# Altium schematic sheet 06_Ethernet_Interface.SchDoc: Mainboard Ethernet
size A3; SheetNumber: 10; SheetTotal: 13
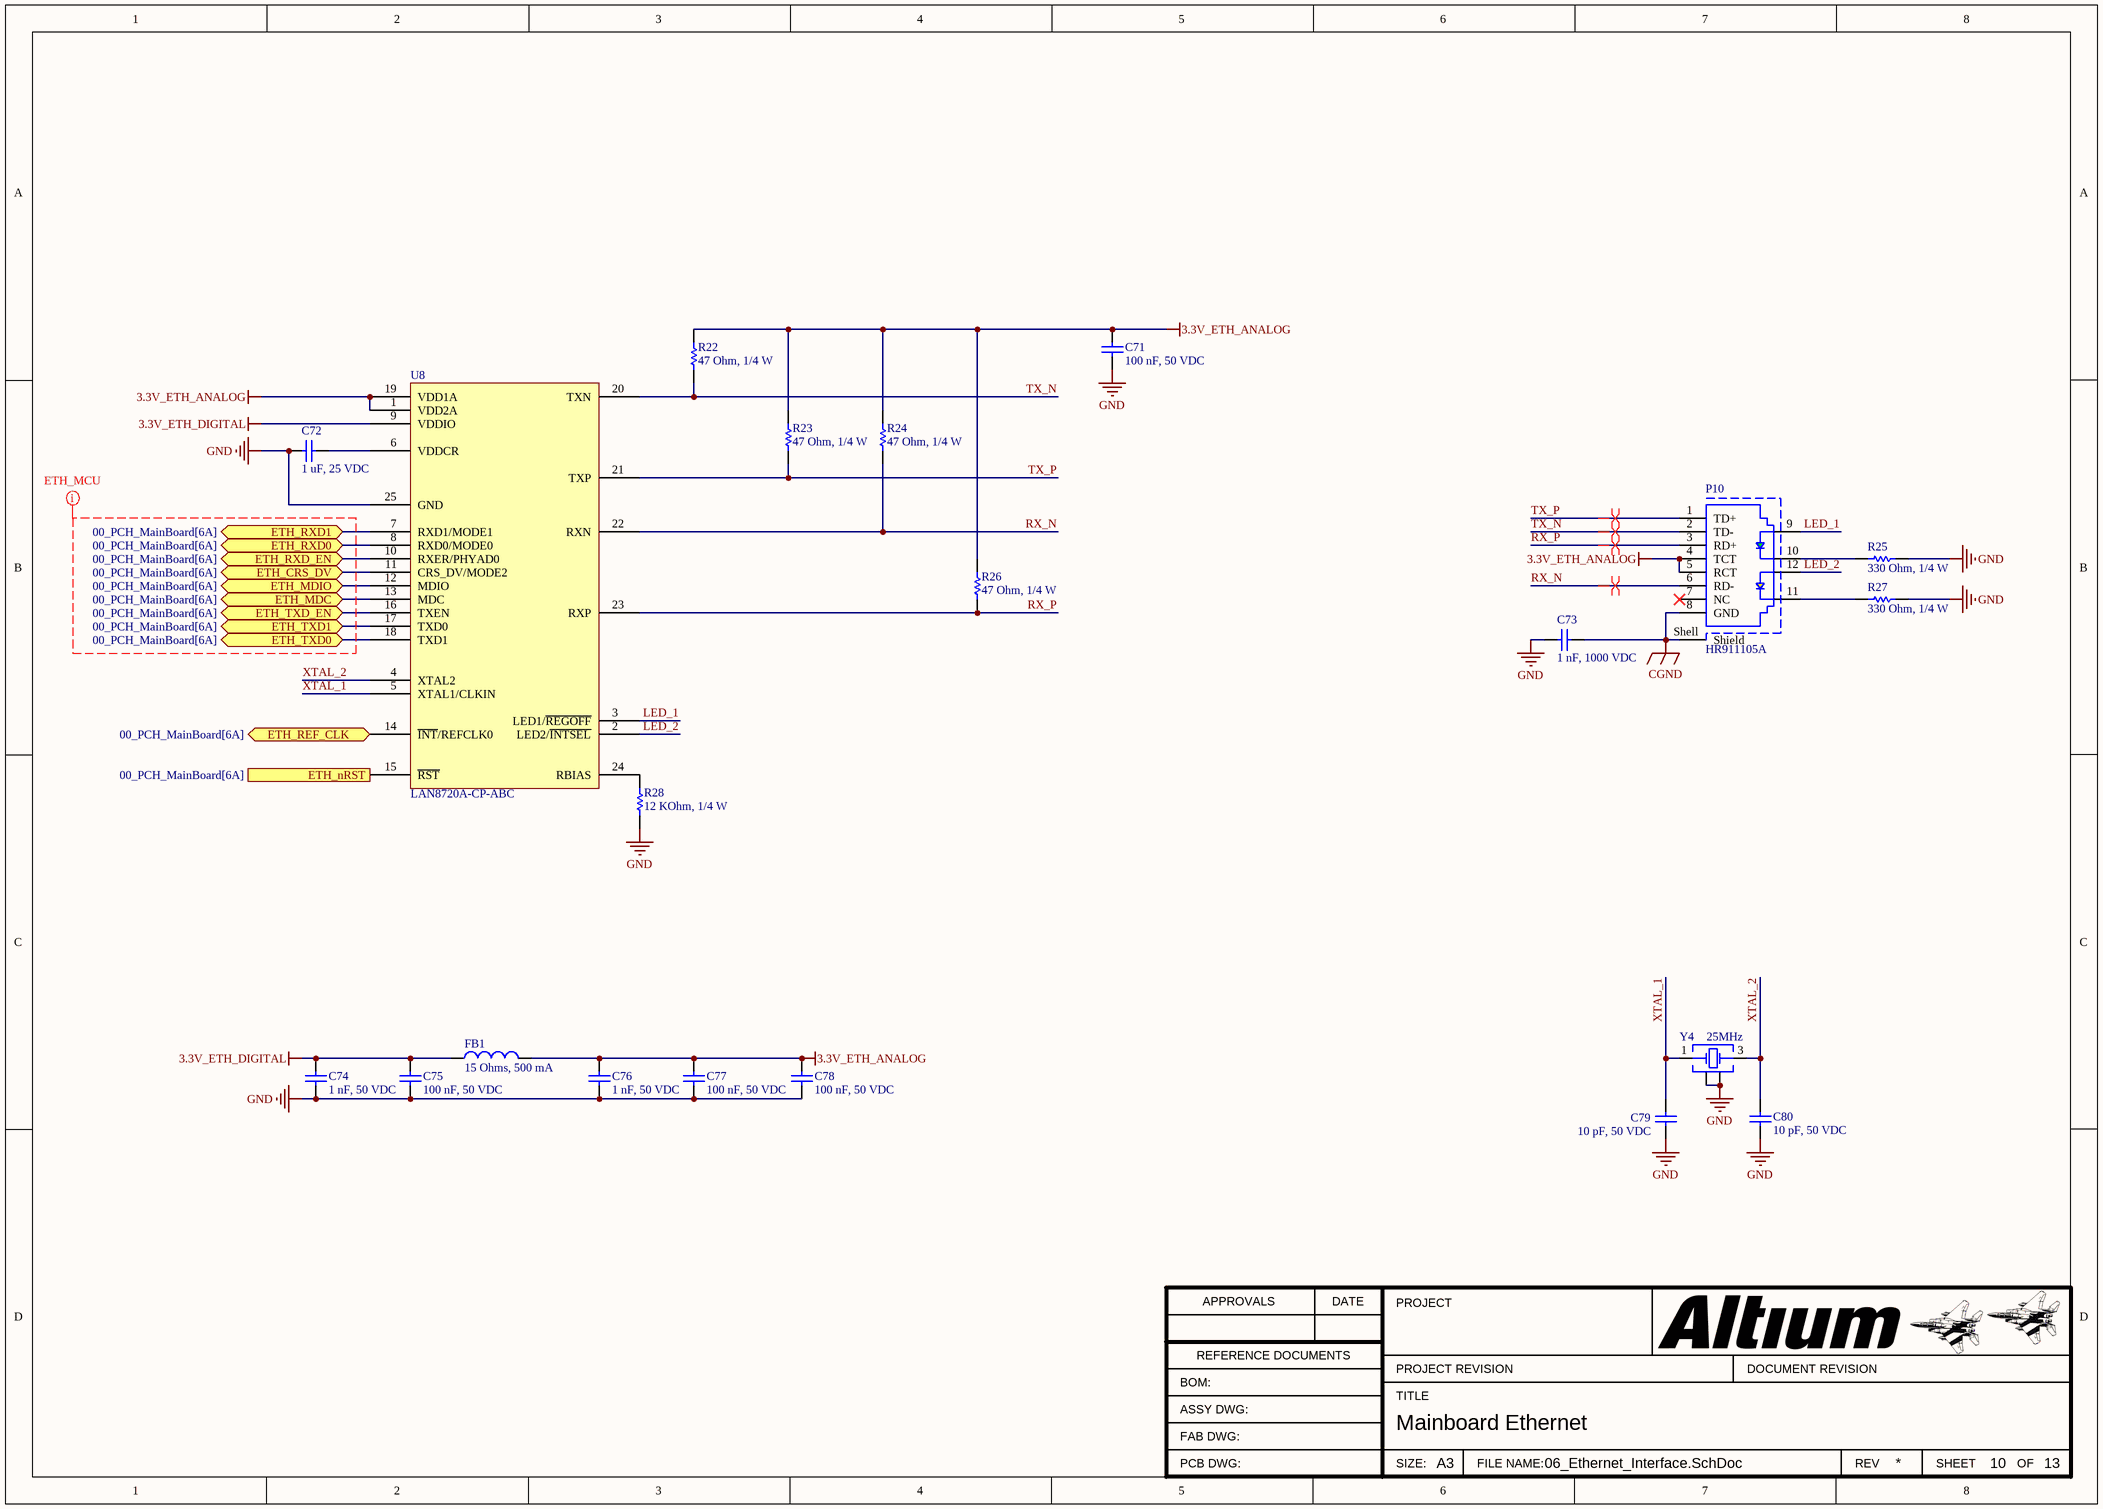
[diagram p0: 06_Ethernet_Interface.SchDoc]

## Parts
C71  100 nF, 50 VDC  [CAP_0603]
C72  1 uF, 25 VDC  [CAP_0603]
C73  1 nF, 1000 VDC  [CAP1210]
C74  1 nF, 50 VDC  [CAP_0603]
C75  100 nF, 50 VDC  [CAP_0603]
C76  1 nF, 50 VDC  [CAP_0603]
C77  100 nF, 50 VDC  [CAP_0603]
C78  100 nF, 50 VDC  [CAP_0603]
C79  10 pF, 50 VDC  [CAP_0603]
C80  10 pF, 50 VDC  [CAP_0603]
FB1  15 Ohms, 500 mA  [FER_0603]
P10  HR911105A  [HANRUN_HR911105A]
R22  47 Ohm, 1/4 W  [resistor_0603]
R23  47 Ohm, 1/4 W  [resistor_0603]
R24  47 Ohm, 1/4 W  [resistor_0603]
R25  330 Ohm, 1/4 W  [resistor_0603]
R26  47 Ohm, 1/4 W  [resistor_0603]
R27  330 Ohm, 1/4 W  [resistor_0603]
R28  12 KOhm, 1/4 W  [resistor_0603]
U8  LAN8720A-CP-ABC  [LAN8720A-CP-ABC]
Y4  25MHz  [WE-XTAL_CFPX-180]

## Ports
ETH_CRS_DV (bidir, see 00_PCH_MainBoard[6A]), ETH_MDC (bidir, see 00_PCH_MainBoard[6A]), ETH_MDIO (bidir, see 00_PCH_MainBoard[6A]), ETH_nRST (in, see 00_PCH_MainBoard[6A]), ETH_REF_CLK (bidir, see 00_PCH_MainBoard[6A]), ETH_RXD0 (bidir, see 00_PCH_MainBoard[6A]), ETH_RXD1 (bidir, see 00_PCH_MainBoard[6A]), ETH_RXD_EN (bidir, see 00_PCH_MainBoard[6A]), ETH_TXD0 (bidir, see 00_PCH_MainBoard[6A]), ETH_TXD1 (bidir, see 00_PCH_MainBoard[6A]), ETH_TXD_EN (bidir, see 00_PCH_MainBoard[6A])

## Nets
3.3V_ETH_ANALOG: C71.2 C76.2 C77.2 C78.2 FB1.2 P10.4(TCT) P10.5(RCT) R22.2 R23.2 R24.2 R26.2 U8.1(VDD2A) U8.19(VDD1A)
3.3V_ETH_DIGITAL: C74.2 C75.2 FB1.1 U8.9(VDDIO)
CGND: C73.2 P10.8(GND) P10.Shell(Shield)
GND: C71.1 C72.1 C73.1 C74.1 C75.1 C76.1 C77.1 C78.1 C79.1 C80.1 R25.2 R27.2 R28.1 U8.25(GND) Y4.2(GND) Y4.4(GND)
ETH_CRS_DV: U8.11(CRS_DV/MODE2) ; port ETH_CRS_DV
ETH_MDC: U8.13(MDC) ; port ETH_MDC
ETH_MDIO: U8.12(MDIO) ; port ETH_MDIO
ETH_nRST: U8.15(~{RST}) ; port ETH_nRST
ETH_REF_CLK: U8.14(~{INT}/REFCLK0) ; port ETH_REF_CLK
ETH_RXD0: U8.8(RXD0/MODE0) ; port ETH_RXD0
ETH_RXD1: U8.7(RXD1/MODE1) ; port ETH_RXD1
ETH_RXD_EN: U8.10(RXER/PHYAD0) ; port ETH_RXD_EN
ETH_TXD0: U8.18(TXD1) ; port ETH_TXD0
ETH_TXD1: U8.17(TXD0) ; port ETH_TXD1
ETH_TXD_EN: U8.16(TXEN) ; port ETH_TXD_EN
LED_1: P10.9 U8.3(LED1/~{REGOFF})
LED_2: P10.12 U8.2(LED2/~{INTSEL})
RX_N: P10.6(RD-) R24.1 U8.22(RXN)
RX_P: P10.3(RD+) R26.1 U8.23(RXP)
TX_N: P10.2(TD-) R22.1 U8.20(TXN)
TX_P: P10.1(TD+) R23.1 U8.21(TXP)
XTAL_1: C79.2 U8.5(XTAL1/CLKIN) Y4.1(Crystal)
XTAL_2: C80.2 U8.4(XTAL2) Y4.3(Crystal)
NetC72_2: C72.2 U8.6(VDDCR)
NetP10_10: P10.10 R25.1
NetP10_11: P10.11 R27.1
NetR28_2: R28.2 U8.24(RBIAS)

Not connected (* = marked no-connect by the designer): P10 7(NC)*

## Layout directives
net class ETH_MCU: (no net found under the mark)
differential pair; differential pair class ETH_TX; net class ETH: TX_N, TX_P
differential pair; differential pair class ETH_RX; net class ETH: RX_N, RX_P

## Notes on the sheet
- APPROVALS
- DATE
- PROJECT
- BOM:
- REFERENCE DOCUMENTS
- TITLE
- PROJECT REVISION
- DOCUMENT REVISION
- ASSY DWG:
- FAB DWG:
- PCB DWG:
- SIZE:
- A3
- FILE NAME:
- REV
- SHEET
- OF

## Library data of the parts
C71 C75 C77 C78 = 0106031041050: CAP, size 0603, 100 nF, 50 VDC; Manufacture Name: TDK; Manufacture SN: CGA3E3X8R1H104K080AE; Capacitance: 100 nF; Tolerance: +/-10%; Voltage Rating DC: 50 VDC; ComponentLink2Description: Datasheet; ComponentLink2URL: https://product.tdk.com/system/files/dam/doc/product/capacitor/ceramic/mlcc/catalog/mlcc_automotive_soft_en.pdf?ref_disty=mouser; Operating Temperature: -55 to +125degC; Packaging: Tape and Reel; Mounting Technology: SMT; Size: 0603; Supplier 1 Name: Mouser; Supplier 1 SN: 810-CGA3E3X8R1H104KA; Supplier 1 URL: https://www.mouser.com/ProductDetail/TDK/CGA3E3X8R1H104K080AE?qs=nQSIdc08i%252Bd8g3IRRgU2bw%3D%3D&utm_source=mouser-refine-download&utm_medium=file&utm_campaign=CGA3E3X8R1H104K080AE&utm_content=TDK; Supplier 2 Name: Digi-Key; Supplier 2 SN: 445-173697-2-ND; Supplier 2 URL: https://www.digikey.com/en/products/detail/tdk-corporation/cga3e3x8r1h104k080ae/5809262; Supplier 3 Name: thegioiic; Supplier 3 SN: N/A; Supplier 3 URL: N/A; Value: 100 nF, 50 VDC
C72 = 0106031051025: CAP, size 0603, 1 uF, 25 VDC; Manufacture Name: Samsung Electro-Mechanics; Manufacture SN: CL10A105KA8NNNC; Capacitance: 1 uF; Tolerance: +/-10%; Voltage Rating DC: 25 VDC; ComponentLink2Description: Datasheet; ComponentLink2URL: https://www.mouser.vn/datasheet/2/585/MLCC-1837944.pdf; Operating Temperature: -55 to +125degC; Packaging: Tape and Reel; Mounting Technology: SMT; Size: 0603; Supplier 1 Name: Mouser; Supplier 1 SN: 187-CL10A105KA8NNNC; Supplier 1 URL: https://www.mouser.vn/ProductDetail/Samsung-Electro-Mechanics/CL10A105KA8NNNC?qs=hqM3L16%252BxldY%252BnK4KzDJVg%3D%3D&utm_source=mouser-refine-download&utm_medium=file&utm_campaign=CL10A105KA8NNNC&utm_content=Samsung-Electro-Mechanics; Supplier 2 Name: Digi-Key; Supplier 2 SN: 1276-1102-2-ND; Supplier 2 URL: https://www.digikey.com/en/products/detail/samsung-electro-mechanics/cl10a105ka8nnnc/3886760; Supplier 3 Name: thegioiic; Supplier 3 SN: N/A; Supplier 3 URL: N/A; Value: 1 uF, 25 VDC
C73 = 011210102101000: CAP, size 1210, 1nF, 1000 VDC; Manufacture Name: TDK; Manufacture SN: C3225C0G3A102J200AE; Tolerance: +/-10%; Capacitance: 1 nF; ComponentLink2Description: Supplier 1 URL; ComponentLink2URL: N/A; Mounting Technology: SMT; Operating Temperature: -55 to +125degC; Packaging: Tape and Reel; Size: 0805; Supplier 1 Name: Mouser; Supplier 1 SN: N/A; Supplier 1 URL: N/A; Supplier 2 Name: Digi-Key; Supplier 2 SN: N/A; Supplier 2 URL: N/A; Supplier 3 Name: thegioiic; Supplier 3 SN: OEM; Supplier 3 URL: https://www.thegioiic.com/tu-gom-1210-1nf-1kv; Value: 1 nF, 1000 VDC; Voltage Rating DC: 1000 VDC; ComponentLink1Description: Datasheet link; ComponentLink1URL: https://product.tdk.com/system/files/dam/doc/product/capacitor/ceramic/mlcc/catalog/mlcc_commercial_soft_en.pdf?ref_disty=mouser; ComponentLink3Description: Supplier 2 URL; ComponentLink3URL: N/A; ComponentLink4Description: Supplier 3 URL; ComponentLink4URL: https://www.thegioiic.com/tu-gom-1210-1nf-1kv
C74 C76 = 0106031051050: CAP, size 0603, 1 nF, 50 VDC; Manufacture Name: TDK; Manufacture SN: CGA3E3X5R1H105K080AB; Capacitance: 1 nF; Tolerance: +/-10%; Voltage Rating DC: 50 VDC; ComponentLink2Description: Datasheet; ComponentLink2URL: https://product.tdk.com/system/files/dam/doc/product/capacitor/ceramic/mlcc/catalog/mlcc_automotive_general_en.pdf?ref_disty=mouser; Operating Temperature: -55 to +125degC; Packaging: Tape and Reel; Mounting Technology: SMT; Size: 0603; Supplier 1 Name: Mouser; Supplier 1 SN: 810-CGA3E3X5R1H105K; Supplier 1 URL: https://www.mouser.com/ProductDetail/TDK/CGA3E3X5R1H105K080AB?qs=NRhsANhppD%2F2%2FwbVN4GABg%3D%3D&utm_source=mouser-refine-download&utm_medium=file&utm_campaign=CGA3E3X5R1H105K080AB&utm_content=TDK; Supplier 2 Name: Digi-Key; Supplier 2 SN: 445-7878-2-ND; Supplier 2 URL: https://www.digikey.com/en/products/detail/tdk-corporation/cga3e3x5r1h105k080ab/2781304; Supplier 3 Name: thegioiic; Supplier 3 SN: N/A; Supplier 3 URL: N/A; Value: 1 nF, 50 VDC
C79 C80 = 0106031000550: CAP, size 0603, 10 pF, 50 VDC; Manufacture Name: TDK; Manufacture SN: CGA3E2NP01H100D080AA; Capacitance: 10 pF; Tolerance: +/-5%; Voltage Rating DC: 50 VDC; ComponentLink2Description: Datasheet; ComponentLink2URL: https://product.tdk.com/system/files/dam/doc/product/capacitor/ceramic/mlcc/catalog/mlcc_automotive_hightemp_en.pdf?ref_disty=mouser; Operating Temperature: -55 to +125degC; Packaging: Tape and Reel; Mounting Technology: SMT; Size: 0603; Supplier 1 Name: Mouser; Supplier 1 SN: 810-CGA3E2NP01H100DA; Supplier 1 URL: https://www.mouser.com/ProductDetail/TDK/CGA3E2NP01H100D080AA?qs=xLDY6iXSiQYSDBjUp7bVxg%3D%3D&utm_source=mouser-refine-download&utm_medium=file&utm_campaign=CGA3E2NP01H100D080AA&utm_content=TDK; Supplier 2 Name: Digi-Key; Supplier 2 SN: 445-12387-2-ND; Supplier 2 URL: https://www.digikey.com/en/products/detail/tdk-corporation/cga3e2np01h100d080aa/3949623; Supplier 3 Name: thegioiic; Supplier 3 SN: N/A; Supplier 3 URL: N/A; Value: 10 pF, 50 VDC
FB1 = 03060315050125: Ferrite, 0603, 15 Ohms, 500 mA; Manufacture Name: Wurth Elektronik; Manufacture SN: 74279268; Tolerance: +/-25%; Impedance: 15 Ohms; Maximum DC Current: 500 mA; Maximum DC Resistance: 100 mOhms; Test Frequency: 100 MHz; ComponentLink2Description: Datasheet; ComponentLink2URL: https://www.we-online.com/catalog/datasheet/74279268.pdf; Mounting Technology: SMT; Operating Temperature: -55 to +125degC; Packaging: Tape and Reel; Size: 0603; Supplier 1 SN: 710-74279268; Supplier 1 URL: https://www.mouser.com/ProductDetail/Wurth-Elektronik/74279268?qs=sGAEpiMZZMt1hubY80%2Fs8M60rIzA20dg6AqiZmQw0jA%3D&utm_source=mouser-refine-download&utm_medium=file&utm_campaign=74279268&utm_content=Wurth-Elektronik; Supplier 2 SN: N/A; Supplier 2 URL: N/A; Supplier 3 SN: N/A; Supplier 3 URL: N/A; Supplier 1 Name: Mouser; Supplier 2 Name: Digi-Key; Supplier 3 Name: thegioiic; Value: 15 Ohms, 500 mA
P10 = HANRUN_HR911105A: Single Port RJ45 Connector with Integrated Magnetics and LED; ComponentLink2Description: Supplier 1 URL; ComponentLink2URL: N/A; Manufacture Name: N/A; Manufacture SN: N/A; Mounting Technology: THT; Operating Temperature: -55 to +125degC; Packaging: N/A; Supplier 1 Name: Mouser; Supplier 1 SN: N/A; Supplier 1 URL: N/A; Supplier 2 Name: Digi-Key; Supplier 2 SN: N/A; Supplier 2 URL: N/A; Supplier 3 Name: thegioiic; Supplier 3 SN: HR911105A; Supplier 3 URL: https://www.thegioiic.com/hr911105a-cong-rj45-cai-co-led-hanrun; Value: HR911105A; ComponentLink1Description: Datasheet link; ComponentLink1URL: https://tme.vn/upload/pdf/HR911105A.pdf; ComponentLink3Description: Supplier 2 URL; ComponentLink3URL: N/A; ComponentLink4Description: Supplier 3 URL; ComponentLink4URL: https://www.thegioiic.com/hr911105a-cong-rj45-cai-co-led-hanrun
R22-R24 R26 = 0006034701: RES, size 0603, 47 Ohm, 1/4 W; Manufacture  Name: OEM; Rated Power: 1/4 W; Resistance: 47 Ohm; Resistance Tolerance: +/-1%; Size: 0603; Mounting Technology: SMT; Supplier 1 Name: Mouser; Supplier 1 SN: 667-ERJ-UP3F47R0V; Supplier 1 URL: https://www.mouser.vn/ProductDetail/Panasonic/ERJ-UP3F47R0V?qs=GedFDFLaBXE9d1Rnv%2Fokmg%3D%3D; Supplier 2 Name: Digi-Key; Supplier 2 SN: 10-ERJ-UP3F47R0VTR-ND - Tape & Reel (TR); Supplier 3 Name: thegioiic; Supplier 3 SN: N/A; Supplier 3 URL: N/A; Manufacture  SN: OEM; Value: 47 Ohm, 1/4 W; ComponentLink1Description: Datasheet link; ComponentLink1URL: https://www.mouser.vn/datasheet/2/315/Panasonic_Resistors_Thick_Film_Anti_Sulf_Anti_Surg-1825099.pdf; ComponentLink2Description: Supplier 1 URL; ComponentLink2URL: N/A; ComponentLink3Description: Supplier 2 URL; ComponentLink3URL: https://www.digikey.com/en/products/detail/panasonic-electronic-components/ERJ-UP3F47R0V/12092512?s=N4IgTCBcDaIGxwOwFoCiAlAUsgqgBQGYAxAFkXQAYA1EAXQF8g; ComponentLink4Description: Supplier 3 URL; ComponentLink4URL: N/A; Supplier 2 URL: https://www.digikey.com/en/products/detail/panasonic-electronic-components/ERJ-UP3F47R0V/12092512?s=N4IgTCBcDaIGxwOwFoCiAlAUsgqgBQGYAxAFkXQAYA1EAXQF8g
R25 R27 = 0006033311: RES, size 0603, 330 Ohm, 1/4 W; Manufacture  Name: OEM; Resistance: 330 Ohm; Rated Power: 1/4 W; Resistance Tolerance: +/-1%; Size: 0603; Mounting Technology: SMT; Supplier 1 Name: Mouser; Supplier 1 SN: 667-ERJ-UP3F3300V; Supplier 2 Name: Digi-Key; Supplier 2 SN: 10-ERJ-UP3F3300VTR-ND 10-ERJ-UP3F3300VCT-ND 10-ERJ-UP3F3300VDKR-ND; Supplier 1 URL: https://www.mouser.vn/ProductDetail/Panasonic/ERJ-UP3F3300V?qs=sGAEpiMZZMvdGkrng054twq3eZrCFN89MDZusw5Tf7mZnfRSpxxqIA%3D%3D; Supplier 3 Name: thegioiic; Supplier 3 SN: N/A; Supplier 3 URL: N/A; Manufacture  SN: OEM; Value: 330 Ohm, 1/4 W; ComponentLink1Description: Datasheet link; ComponentLink1URL: https://api.pim.na.industrial.panasonic.com/file_stream/main/fileversion/4484; ComponentLink2Description: Supplier 1 URL; ComponentLink2URL: N/A; ComponentLink3Description: Supplier 2 URL; ComponentLink3URL: https://www.digikey.com/en/products/detail/panasonic-electronic-components/ERJ-UP3F3300V/12093106; ComponentLink4Description: Supplier 3 URL; ComponentLink4URL: N/A; Supplier 2 URL: https://www.digikey.com/en/products/detail/panasonic-electronic-components/ERJ-UP3F3300V/12093106
R28 = 0006031235: RES, size 0603, 12 KOhm, 1/4 W; Manufacture  Name: Panasonic; Rated Power: 1/4 W; Resistance: 12 KOhm; Resistance Tolerance: +/-5%; Size: 0603; Mounting Technology: SMT; Supplier 1 Name: Mouser; Supplier 1 SN: 667-ERJ-PA3J123V; Supplier 1 URL: https://www.mouser.vn/ProductDetail/Panasonic/ERJ-PA3J123V?qs=BzJM0faLVqUmhFLBcKz%2F9g%3D%3D; Supplier 2 Name: Digi-Key; Supplier 2 SN: P12KBZTR-ND - Tape & Reel (TR); Supplier 3 Name: thegioiic; Supplier 3 SN: N/A; Supplier 3 URL: https://www.thegioiic.com/dien-tro-12-kohm-0603-5; Value: 12 KOhm, 1/4 W; ComponentLink1Description: Datasheet link; ComponentLink1URL: https://www.mouser.vn/datasheet/2/315/AOA0000C331-1141874.pdf; ComponentLink2Description: Supplier 1 URL; ComponentLink2URL: N/A; ComponentLink3Description: Supplier 2 URL; ComponentLink3URL: https://www.digikey.com/en/products/detail/panasonic-electronic-components/ERJ-PA3J123V/5035982?s=N4IgTCBcDaIGxwOwFoCiAlAUsgCgQQGZMBGMAgNRAF0BfIA; ComponentLink4Description: Supplier 3 URL; ComponentLink4URL: N/A; Supplier 2 URL: https://www.digikey.com/en/products/detail/panasonic-electronic-components/ERJ-PA3J123V/5035982?s=N4IgTCBcDaIGxwOwFoCiAlAUsgCgQQGZMBGMAgNRAF0BfIA
U8 = LAN8720A-CP-ABC: Ethernet ICs Small Footprint RMII RMII 10/100 Ethernet; Manufacturer: Microchip Technology; Active status: Active; Pad count: 24; ComponentLink1Description: Datasheet; ComponentLink1URL: https://www.mouser.com/datasheet/2/268/00002165B-977427.pdf; Footprint name: SQFN-24; Manufacture SN: LAN8720A-CP-ABC; Protocol: RMII; ComponentLink2Description: Supplier 1 URL; ComponentLink2URL: https://www.mouser.com/ProductDetail/Microchip-Technology/LAN8720A-CP-ABC?qs=Gd3Cm49KlLPCUEGQe1b4LA%3D%3D; ComponentLink3Description: Supplier 2 URL; ComponentLink3URL: https://www.digikey.com/en/products/detail/microchip-technology/LAN8720A-CP-TR-ABC/9168867; ComponentLink4Description: Supplier 3 URL; ComponentLink4URL: N/A; Supplier 1 Name: Mouser; Supplier 1 SN: 579-LAN8720ACPABC; Supplier 1 URL: https://www.mouser.com/ProductDetail/Microchip-Technology/LAN8720A-CP-ABC?qs=Gd3Cm49KlLPCUEGQe1b4LA%3D%3D; Supplier 2 Name: Digi-Key; Supplier 2 SN: LAN8720A-CP-TR-ABCTR-ND; Supplier 2 URL: https://www.digikey.com/en/products/detail/microchip-technology/LAN8720A-CP-TR-ABC/9168867; Supplier 3 Name: thegioiic; Supplier 3 SN: N.A; Supplier 3 URL: https://www.thegioiic.com/lan8720a-ic-truyen-nhan-ethernet-24-qfn; Value: LAN8720A-CP-ABC
Y4 = 073525256008: WE-XTAL Quartz Crystal, SMT, CFPX-180, 25MHz, +/-10ppm; Manufacturer Part Number: NX3225GA-25.000M-STD-CRG-1; Manufacturer: NDK; Frequency Stability: +/-30ppm; Load Capacitance: 8pF; Frequency Tolerance: +/-20ppm; ComponentLink2Description: Supplier 1 URL; ComponentLink2URL: https://www.mouser.com/ProductDetail/NDK/NX3225GA-25.000M-STD-CRG-1?qs=w%2Fv1CP2dgqrtPHjsihYWzQ%3D%3D; Operating Temperature: -10 to +60degC; Size: CFPX-104/5032; Frequency: 25MHz; Mounting Technology: SMT; Supplier 3 Name: thegioiic; Supplier 3 SN: N/A; Supplier 3 URL: https://www.thegioiic.com/thach-anh-25mhz-5032-4-chan-smd; ComponentLink1Description: Datasheet link; ComponentLink1URL: https://www.mouser.com/datasheet/2/905/ndk_08142018_NX3225GA-27.000M-STD-CRG-1-1389019.pdf; ComponentLink3Description: Supplier 2 URL; ComponentLink3URL: N/A; ComponentLink4Description: Supplier 3 URL; ComponentLink4URL: https://www.thegioiic.com/thach-anh-25mhz-5032-4-chan-smd; Supplier 1 Name: Mouser; Supplier 1 SN: 344-NX3225GA25MSTRG1; Supplier 1 URL: https://www.mouser.com/ProductDetail/NDK/NX3225GA-25.000M-STD-CRG-1?qs=w%2Fv1CP2dgqrtPHjsihYWzQ%3D%3D; Supplier 2 Name: Digi-Key; Supplier 2 SN: N/A; Supplier 2 URL: N/A; Value: 25MHz